# Altium schematic sheet DebugLEDs.SchDoc
size A4; SheetNumber: 6; SheetTotal: 6
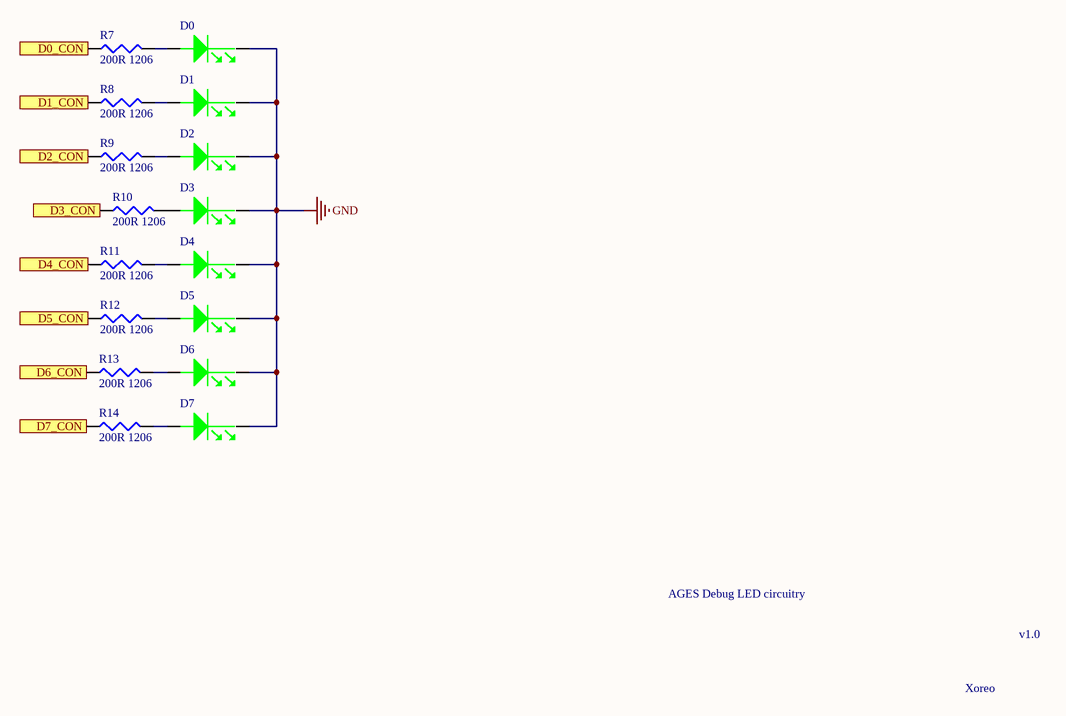
[diagram p0: DebugLEDs.SchDoc]

## Parts
D0  LEDG  [LEDC3216X120N]  (value not drawn)
D1  LEDG  [LEDC3216X120N]  (value not drawn)
D2  LEDG  [LEDC3216X120N]  (value not drawn)
D3  LEDG  [LEDC3216X120N]  (value not drawn)
D4  LEDG  [LEDC3216X120N]  (value not drawn)
D5  LEDG  [LEDC3216X120N]  (value not drawn)
D6  LEDG  [LEDC3216X120N]  (value not drawn)
D7  LEDG  [LEDC3216X120N]  (value not drawn)
R7  200R 1206  [Resistor 1206]
R8  200R 1206  [Resistor 1206]
R9  200R 1206  [Resistor 1206]
R10  200R 1206  [Resistor 1206]
R11  200R 1206  [Resistor 1206]
R12  200R 1206  [Resistor 1206]
R13  200R 1206  [Resistor 1206]
R14  200R 1206  [Resistor 1206]

## Ports
D0_CON, D1_CON, D2_CON, D3_CON, D4_CON, D5_CON, D6_CON, D7_CON

## Nets
GND: D0.NEG(+) D1.NEG(+) D2.NEG(+) D3.NEG(+) D4.NEG(+) D5.NEG(+) D6.NEG(+) D7.NEG(+)
D0_CON: R7.1 ; port D0_CON
D1_CON: R8.1 ; port D1_CON
D2_CON: R9.1 ; port D2_CON
D3_CON: R10.1 ; port D3_CON
D4_CON: R11.1 ; port D4_CON
D5_CON: R12.1 ; port D5_CON
D6_CON: R13.1 ; port D6_CON
D7_CON: R14.1 ; port D7_CON
NetD0_POS: D0.POS R7.2
NetD1_POS: D1.POS R8.2
NetD2_POS: D2.POS R9.2
NetD3_POS: D3.POS R10.2
NetD4_POS: D4.POS R11.2
NetD5_POS: D5.POS R12.2
NetD6_POS: D6.POS R13.2
NetD7_POS: D7.POS R14.2

## Notes on the sheet
- AGES Debug LED circuitry
- v1.0
- Xoreo

## Library data of the parts
D0-D7 = LED: LED Uni-Color SB. Green 565nm 2-Pin Chip LED T/R; Manufacturer: Kingbright; Manufacturer Part Number: KPT-3216SGC; Lens Color: Clear; Lens Style: Rectangular,Diffused,Colorless; Viewing Angle: 120°; Number of LEDs: 1; Luminous Intensity: 12mcd; Forward Voltage: 2.2V; Wavelength: 568nm; Forward Current: 20mA; Supplier 1: RSComponents; RoHS: Yes; Category: LEDs; Stock 1: 1; Pricing 1: 100=0,14200, 500=0,13500, 1000=0,11800, 2000=0,10700, 8000=0,10500 (USD); Mount: Surface Mount; Case/Package: 3216; Number of Pins: 2; Color: Green; Packaging: Tape and Reel; Dominant Wavelength: 568nm; Series: 1206; Radiation Hardening: No; REACH SVHC: No SVHC; RoHS Compliant: Yes; ComponentLink1URL: https://datasheet.ciiva.com/23674/1563720-23674567.pdf?src-supplier=Newark; ComponentLink1Description: https://datasheet.ciiva.com/23674/1563720-23674567.pdf?src-supplier=Newark; Supplier Part Number 1: 8610204P
R7-R14 = Resistor: 200R: Surface Mount Thick Film Resistor, AEC-Q200 ERJ Series, 200 ohm, 250 mW, - 1%, 200 V; Manufacturer: Panasonic; Manufacturer Part Number: ERJ-U08F2000V; Temperature Coefficient: 100ppm/°C; Power Rating: 250mW; Voltage Rating: 200V; Current Rating: 2A; Supplier 1: Rs; RoHS: Yes; Category: Chip SMD Resistors; Stock 1: 6900; Pricing 1: 4000=0,04900 (EUR); Case/Package: 1206; Case Code (Imperial): 1206; Case Code (Metric): 3216; Weight: 0.000571oz; Min Operating Temperature: -55°C; Max Operating Temperature: 155°C; Packaging: Tape and Reel; Resistance: 200R; Tolerance: 1%; Resistor Type: Thick Film; Series: ERJ-U08; Termination: SMD/SMT; Package Quantity: 5000; Voltage Rating (DC): 200V; Resistance Tolerance: 1%; Technology: THICK FILM; Length: 3.2mm; Width: 1.6mm; Height: 0.6mm; Depth: 1.6mm; RoHS Compliant: Yes; Reach SVHC Compliant: Yes; ComponentLink1URL: https://datasheet.ciiva.com/7891/1638979-7891542.pdf?src-supplier=Element14; ComponentLink1Description: https://datasheet.ciiva.com/7891/1638979-7891542.pdf?src-supplier=Element14; ComponentLink2URL: https://datasheet.ciiva.com/24195/ras-erj-u-267552-24195551.pdf?src-supplier=Mouser; ComponentLink2Description: https://datasheet.ciiva.com/24195/ras-erj-u-267552-24195551.pdf?src-supplier=Mouser; Supplier Part Number 1: 1723988